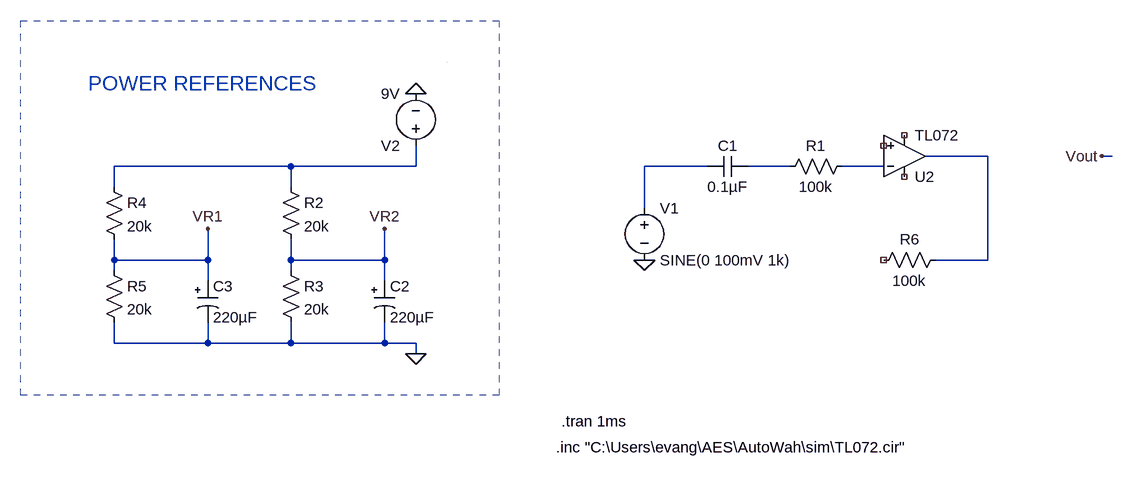
[diagram p0: schematic autowah.asc]
autowah.asc, the LTspice schematic file:
Version 4.1
SHEET 1 1052 1012
WIRE 832 144 736 144
WIRE 1024 144 1008 144
WIRE -240 160 -512 160
WIRE -48 160 -48 128
WIRE -48 160 -240 160
WIRE 400 160 304 160
WIRE 528 160 464 160
WIRE 672 160 608 160
WIRE -512 192 -512 160
WIRE -240 192 -240 160
WIRE 304 224 304 160
WIRE -512 304 -512 272
WIRE -368 304 -368 256
WIRE -368 304 -512 304
WIRE -240 304 -240 272
WIRE -96 304 -96 256
WIRE -96 304 -240 304
WIRE 832 304 832 144
WIRE 832 304 752 304
WIRE -512 320 -512 304
WIRE -240 320 -240 304
WIRE -368 336 -368 304
WIRE -96 336 -96 304
WIRE -512 432 -512 400
WIRE -368 432 -368 400
WIRE -368 432 -512 432
WIRE -240 432 -240 400
WIRE -240 432 -368 432
WIRE -96 432 -96 400
WIRE -96 432 -240 432
WIRE -48 432 -96 432
WIRE -48 448 -48 432
WIRE 0 0 0 0
FLAG -48 48 0
FLAG 304 304 0
FLAG 1008 144 Vout
FLAG -96 256 VR2
FLAG -368 256 VR1
FLAG -48 448 0
SYMBOL voltage 304 208 R0
WINDOW 123 0 0 Left 0
WINDOW 39 0 0 Left 0
SYMATTR InstName V1
SYMATTR Value SINE(0 100mV 1k)
SYMBOL res 624 144 R90
WINDOW 0 0 56 VBottom 2
WINDOW 3 32 56 VTop 2
SYMATTR InstName R1
SYMATTR Value 100k
SYMBOL OpAmps\\opamp2 704 208 M180
SYMATTR InstName U2
SYMATTR Value TL072
SYMBOL voltage -48 144 R180
WINDOW 123 0 0 Left 0
WINDOW 39 0 0 Left 0
SYMATTR InstName V2
SYMATTR Value 9V
SYMBOL cap 464 144 R90
WINDOW 0 0 32 VBottom 2
WINDOW 3 32 32 VTop 2
SYMATTR InstName C1
SYMATTR Value 0.1µF
SYMBOL res -256 176 R0
SYMATTR InstName R2
SYMATTR Value 20k
SYMBOL res -256 304 R0
SYMATTR InstName R3
SYMATTR Value 20k
SYMBOL res -528 176 R0
SYMATTR InstName R4
SYMATTR Value 20k
SYMBOL res -528 304 R0
SYMATTR InstName R5
SYMATTR Value 20k
SYMBOL polcap -384 336 R0
SYMATTR InstName C3
SYMATTR Value 220µF
SYMBOL polcap -112 336 R0
SYMATTR InstName C2
SYMATTR Value 220µF
SYMBOL res 768 288 R90
WINDOW 0 0 56 VBottom 2
WINDOW 3 32 56 VTop 2
SYMATTR InstName R6
SYMATTR Value 100k
TEXT 168 592 Left 2 !.inc "C:\\Users\\evang\\AES\\AutoWah\\sim\\TL072.cir"
TEXT 176 552 Left 2 !.tran 1ms
TEXT -552 32 Left 3 ;POWER REFERENCES
RECTANGLE Normal 80 512 -656 -64 2

The netlist it stands for:
* autowah.asc
V1 N003 0 SINE(0 100mV 1k)
R1 N005 N004 100k
X§U2 NC_01 N005 NC_02 NC_03 N001 TL072  ; pins In+ In- V+ V- OUT
V2 N002 0 9V
C1 N004 N003 0.1µF
R2 N002 VR2 20k
R3 VR2 0 20k
R4 N002 VR1 20k
R5 VR1 0 20k
C3 VR1 0 220µF
C2 VR2 0 220µF
R6 N001 NC_04 100k
.inc "C:\Users\evang\AES\AutoWah\sim\TL072.cir"
.tran 1ms
* POWER REFERENCES
.backanno
.end